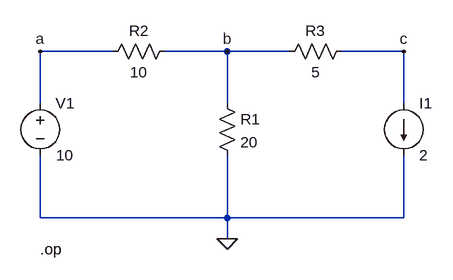
[diagram p0: schematic circuit1.asc]
circuit1.asc, the LTspice schematic file:
Version 4
SHEET 1 880 680
WIRE -112 16 -224 16
WIRE 64 16 -32 16
WIRE 160 16 64 16
WIRE 336 16 240 16
WIRE -224 96 -224 16
WIRE 64 96 64 16
WIRE 336 96 336 16
WIRE -224 272 -224 176
WIRE 64 272 64 176
WIRE 64 272 -224 272
WIRE 336 272 336 176
WIRE 336 272 64 272
WIRE 64 304 64 272
FLAG 64 304 0
FLAG -224 16 a
FLAG 64 16 b
FLAG 336 16 c
SYMBOL current 336 96 R0
SYMATTR InstName I1
SYMATTR Value 2
SYMBOL voltage -224 80 R0
WINDOW 3 38 96 Center 2
SYMATTR InstName V1
SYMATTR Value 10
SYMBOL res 48 80 R0
SYMATTR InstName R1
SYMATTR Value 20
SYMBOL res -128 32 R270
WINDOW 0 32 56 VTop 2
WINDOW 3 0 56 VBottom 2
SYMATTR InstName R2
SYMATTR Value 10
SYMBOL res 144 32 R270
WINDOW 0 32 56 VTop 2
WINDOW 3 0 56 VBottom 2
SYMATTR InstName R3
SYMATTR Value 5
TEXT -224 320 Left 2 !.op

The netlist it stands for:
* circuit1.asc
I1 c 0 2
V1 a 0 10
R1 b 0 20
R2 a b 10
R3 b c 5
.op
.backanno
.end

* Results of the author's LTspice run, read from the files saved beside the schematic
* Operating Point:
*   V(c) = -16.67 V
*   V(a) = 10 V
*   V(b) = -6.667 V
*   I(I1) = 2 A
*   I(R1) = -333.3 mA
*   I(R2) = 1.667 A
*   I(R3) = 2 A
*   I(V1) = -1.667 A